# Altium schematic sheet CLK_Mezzanine.SchDoc: =ProjectName
size 420 x 297 mm; Author: SBH; CompanyName: WUT; DrawnBy: SBH; Organization: ISE-WUT; Address1: Warsaw Univeristy of Technology; Address2: Nowowiejska 15/19; DocumentNumber: 10; Revision: -; SheetNumber: 10; SheetTotal: 12; EDA_Number: ARTIQ; Projet: eRTM15 Baikal; ModifiedBy: -; CreateDate: XX/XX/XXXX; CheckedDate: -; Title2: CLK_Mezzanine.SchDoc; DivGrp: ISE; Designer: SBH; ModifiedDate: -; ProjectName: eRTM15 Baikal
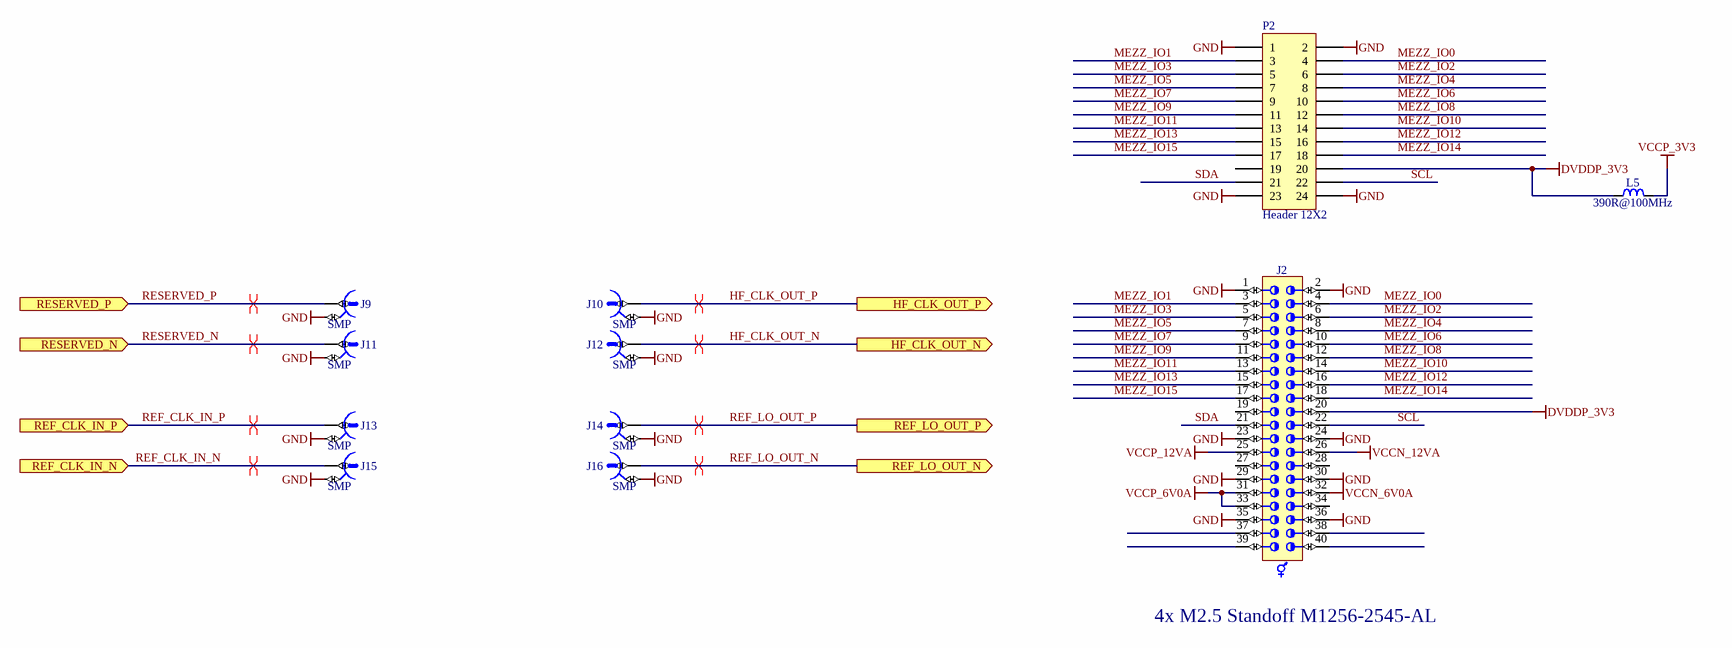
[diagram p0: CLK_Mezzanine.SchDoc]

## Parts
J2  (no value)  [SAMTEC_LSS-120-03-L-DV-A]
J9  SMP  [MOLEX_85305-0232]
J10  SMP  [MOLEX_85305-0232]
J11  SMP  [MOLEX_85305-0232]
J12  SMP  [MOLEX_85305-0232]
J13  SMP  [MOLEX_85305-0232]
J14  SMP  [MOLEX_85305-0232]
J15  SMP  [MOLEX_85305-0232]
J16  SMP  [MOLEX_85305-0232]
L5  390R@100MHz  [INDC1608X95N]
P2  Header 12X2  [HDR2X12]

## Ports
HF_CLK_OUT_N (out), HF_CLK_OUT_P (out), REF_CLK_IN_N (in), REF_CLK_IN_P (in), REF_LO_OUT_N (out), REF_LO_OUT_P (out), RESERVED_N (in), RESERVED_P (in)

## Nets
DVDDP_3V3: J2.20 L5.1 P2.20
GND: J2.1 J2.2 J2.23 J2.24 J2.29 J2.30 J2.35 J2.36 J9.2 J10.2 J11.2 J12.2 J13.2 J14.2 J15.2 J16.2 P2.1 P2.2 P2.23 P2.24
VCCN_6V0A: J2.32
VCCN_12VA: J2.26
VCCP_3V3: L5.2
VCCP_6V0A: J2.31 J2.33
VCCP_12VA: J2.25
HF_CLK_OUT_N: J12.1 ; port HF_CLK_OUT_N
HF_CLK_OUT_P: J10.1 ; port HF_CLK_OUT_P
MEZZ_IO0: J2.4 P2.4
MEZZ_IO1: J2.3 P2.3
MEZZ_IO2: J2.6 P2.6
MEZZ_IO3: J2.5 P2.5
MEZZ_IO4: J2.8 P2.8
MEZZ_IO5: J2.7 P2.7
MEZZ_IO6: J2.10 P2.10
MEZZ_IO7: J2.9 P2.9
MEZZ_IO8: J2.12 P2.12
MEZZ_IO9: J2.11 P2.11
MEZZ_IO10: J2.14 P2.14
MEZZ_IO11: J2.13 P2.13
MEZZ_IO12: J2.16 P2.16
MEZZ_IO13: J2.15 P2.15
MEZZ_IO14: J2.18 P2.18
MEZZ_IO15: J2.17 P2.17
REF_CLK_IN_N: J15.1 ; port REF_CLK_IN_N
REF_CLK_IN_P: J13.1 ; port REF_CLK_IN_P
REF_LO_OUT_N: J16.1 ; port REF_LO_OUT_N
REF_LO_OUT_P: J14.1 ; port REF_LO_OUT_P
RESERVED_N: J11.1 ; port RESERVED_N
RESERVED_P: J9.1 ; port RESERVED_P
SCL: J2.22 P2.22
SDA: J2.21 P2.21

Not connected (* = marked no-connect by the designer): J2 19 27 28 34 37 38 39 40; P2 19

## Layout directives
differential pair: HF_CLK_OUT_N, HF_CLK_OUT_P, REF_CLK_IN_N, REF_CLK_IN_P, REF_LO_OUT_N, REF_LO_OUT_P, RESERVED_N, RESERVED_P

## Notes on the sheet
- 4x M2.5 Standoff M1256-2545-AL
- Project/Equipment
- Document
- Designer
- Drawn by
- Check.by
- File
- Last Mod.
- Print Date
- Sheet
- Size
- A3
- of
- Rev

## Library data of the parts
J2 = SAMTEC_LSS-120-03-L-DV-A: Connector 40 Hermaphroditic; Part Description: 40 Contacts, Pitch 0.635mm, Razor Beam LSS Vertical High Speed Hermaphroditic Strip (Lead Style 5.49mm); Manufacturer: SAMTEC; PressFit: No; Part Number: SAMTEC_LSS-120-03-L-DV-A; Component Kind: Standard; Component Type: Standard; Pin Count: 40; Mounted: Yes; Socket: No; Sense: No; SMD: Yes; Status: None; Manufacturer Part Number: LSS-120-03-L-DV-A; ComponentHeight: 5.57mm; HelpURL: \\cern.ch\dfs\Applications\Altium\Datasheets\SAMTEC_LSS-120-03-L-DV-A.pdf; Author: CERN DEM JMW; CreateDate: 10.11.2015; LatestRevisionDate: 10.11.2015
J9-J16 = MOLEX_85305-0232: Part Description: 50 Ohms, SMP Surface Mount Plug, Limited Detent; Manufacturer: MOLEX; PressFit: No; Part Number: MOLEX_85305-0232; Component Kind: Standard; Component Type: Standard; Pin Count: 2; Family: SMP; Mounted: Yes; Socket: No; SMD: Yes; Sense: No; Status: None; Manufacturer Part Number: 85305-0232; ComponentHeight: 4.1mm; HelpURL: \\cern.ch\dfs\Applications\Altium\Datasheets\MOLEX_85305-0232.pdf; Author: CERN DEM JMW; CreateDate: 09.08.2016; LatestRevisionDate: 09.08.2016
L5 = IND0603_TDK_MPZ1608R391A: Inductor; Part Description: SMT Chip Bead for Power Line; Manufacturer: TDK; Power: 1.2A; Resistance: 0.12R; Tolerance: ±25%; Part Number: IND0603_TDK_MPZ1608R391A; Component Kind: Standard; Component Type: Standard; Pin Count: 2; Value: 390R@100MHz; Status: None; Manufacturer Part Number: MPZ1608R391A; Case: 0603; Mounted: Yes; Socket: No; SMD: Yes; Sense: No; ComponentHeight: 0.95mm; HelpURL: \\cern.ch\dfs\Applications\Altium\Datasheets\IND0603_TDK_MPZ1608.pdf; Author: CERN DEM JLC; CreateDate: 2009-12-02; LatestRevisionDate: 2009-12-02
P2 = Header 12X2: Header, 12-Pin, Dual row; LatestRevisionDate: 17-Jul-2002; LatestRevisionNote: Re-released for DXP Platform.; Publisher: Altium Limited